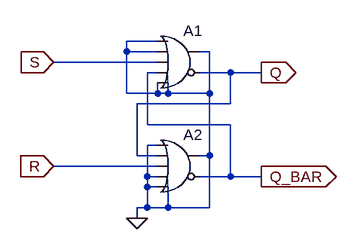
[diagram p0: schematic Draft9.asc]
Draft9.asc, the LTspice schematic file:
Version 4
SHEET 1 880 680
WIRE 144 80 96 80
WIRE 96 96 96 80
WIRE 144 96 96 96
WIRE 224 96 208 96
WIRE 144 112 -16 112
WIRE 144 128 128 128
WIRE 256 128 208 128
WIRE 304 128 256 128
WIRE 96 160 96 96
WIRE 144 160 144 144
WIRE 144 160 96 160
WIRE 160 160 160 144
WIRE 160 160 144 160
WIRE 224 160 224 96
WIRE 224 160 160 160
WIRE 256 176 256 128
WIRE 256 176 112 176
WIRE 128 208 128 128
WIRE 256 208 128 208
WIRE 144 240 128 240
WIRE 112 256 112 176
WIRE 144 256 112 256
WIRE 224 256 224 160
WIRE 224 256 208 256
WIRE 144 272 -16 272
WIRE 128 288 128 240
WIRE 144 288 128 288
WIRE 256 288 256 208
WIRE 256 288 208 288
WIRE 304 288 256 288
WIRE 128 304 128 288
WIRE 144 304 128 304
WIRE 128 336 128 304
WIRE 128 336 112 336
WIRE 160 336 160 304
WIRE 160 336 128 336
WIRE 224 336 224 256
WIRE 224 336 160 336
WIRE 112 352 112 336
FLAG 112 352 0
FLAG -16 112 S
IOPIN -16 112 In
FLAG -16 272 R
IOPIN -16 272 In
FLAG 304 128 Q
IOPIN 304 128 Out
FLAG 304 288 Q_BAR
IOPIN 304 288 Out
SYMBOL Digital\\or 176 48 R0
SYMATTR InstName A1
SYMBOL Digital\\or 176 208 R0
SYMATTR InstName A2

The netlist it stands for:
* Draft9.asc
A1 0 0 S Q_BAR 0 Q 0 0 OR
A2 0 Q R 0 0 Q_BAR 0 0 OR
.backanno
.end